# Altium schematic sheet CPU.SchDoc: CPU
size A4; DrawnBy: Mangelschots Emiel; SheetNumber: 5; SheetTotal: 5; Parameter 1: /; Parameter 2: 1EAID 12302093
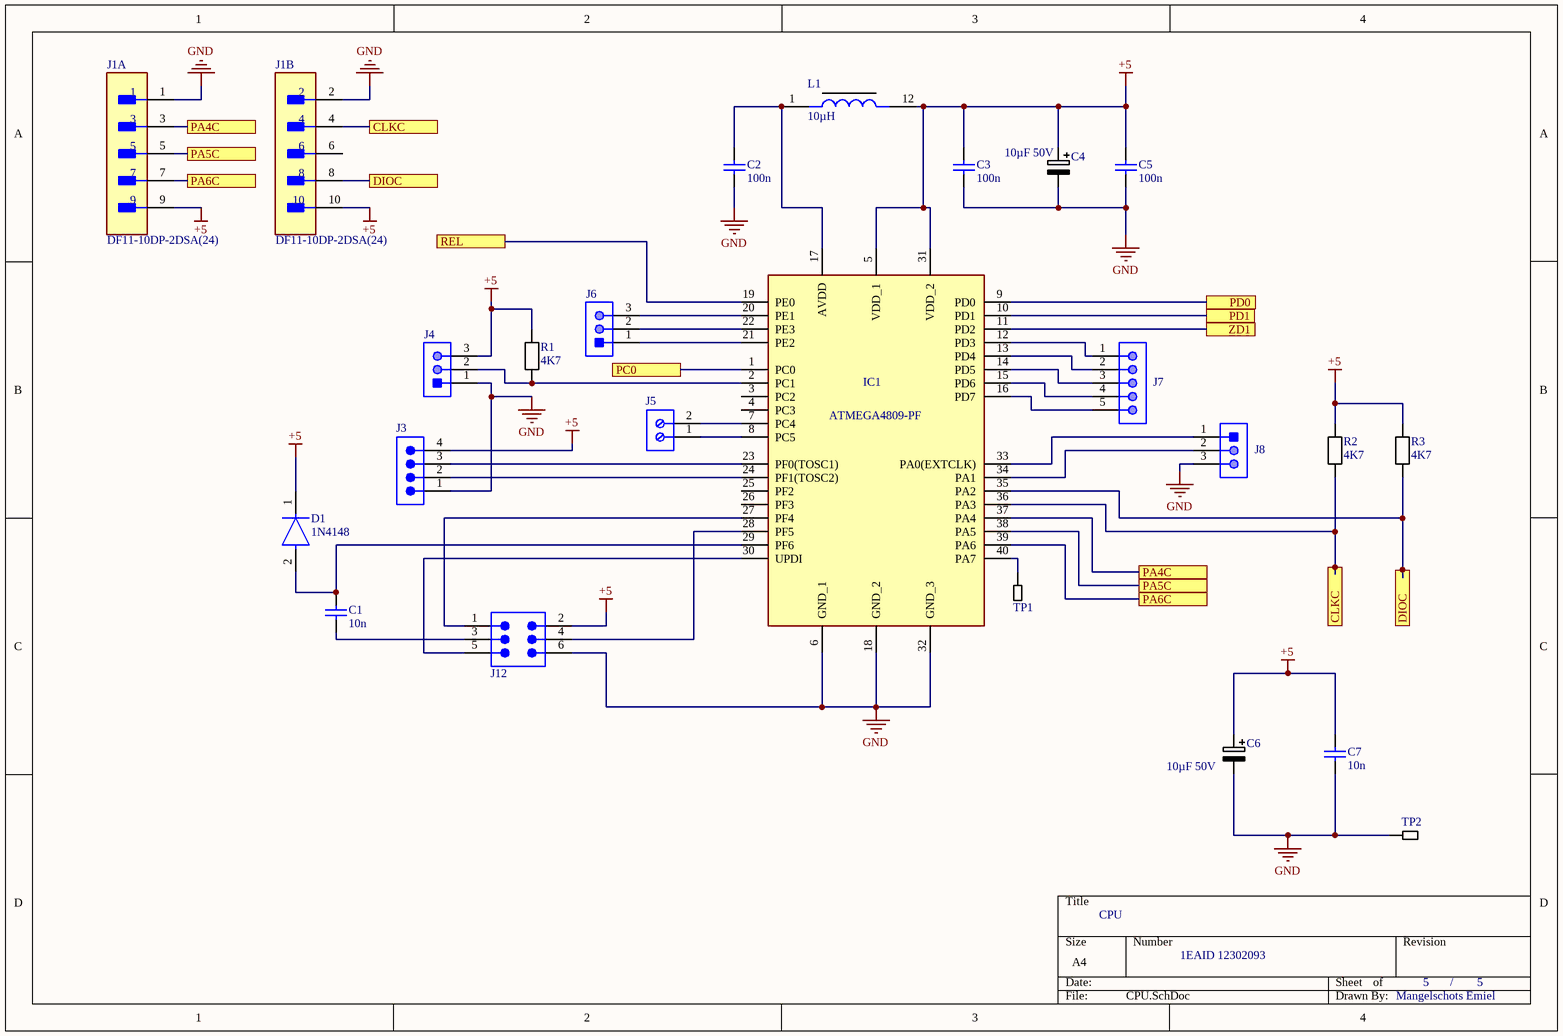
[diagram p0: CPU.SchDoc]

## Parts
C1  10n  [CAPA]
C2  100n  [CAPA]
C3  100n  [CAPA]
C4  10µF 50V  [CAPA1]
C5  100n  [CAPA]
C6  10µF 50V  [CAPA1]
C7  10n  [CAPA]
D1  1N4148  [DIOD]
IC1  ATMEGA4809-PF  [CPU]
J1  DF11-10DP-2DSA(24)  [FP-DF11-10DP-2DSA_24-MFG]  (parts A,B of 2)
J3  640456-4  [4PinH]  (value not drawn)
J4  B3B-PH-K-S(LF)(SN)  [3PinH]  (value not drawn)
J5  1725656  [2 pinHeader]  (value not drawn)
J6  B3B-PH-K-S(LF)(SN)  [3PinH]  (value not drawn)
J7  53261-0571  [5PinH]  (value not drawn)
J8  B3B-PH-K-S(LF)(SN)  [3PinH]  (value not drawn)
J12  610106249121  [6Pin-Header]  (value not drawn)
L1  10µH  [Smoorspoel]
R1  4K7  [REST]
R2  4K7  [REST]
R3  4K7  [REST]
TP1  TP  [TP]  (value not drawn)
TP2  TP  [TP]  (value not drawn)

## Ports
CLKC (see CPU[1A]), CLKC (see CPU[4C]), DIOC (see CPU[1A]), DIOC (see CPU[4C]), PA4C (see CPU[1A]), PA4C (see CPU[3C]), PA5C (see CPU[1A]), PA5C (see CPU[3C]), PA6C (see CPU[1A]), PA6C (see CPU[3C]), PC0 (see SolBout[1C]), PD0 (see SolBin[1B]), PD1 (see SolBin[1C]), REL (see VoedingBat20V[1B]), ZD1 (see VoedingBat20V[3B])

## Nets
+5: C3.2 C4.1 C5.2 C6.1 C7.2 D1.1(C) IC1.5(VDD_1) IC1.31(VDD_2) J1.9 J1.10 J3.4 J4.3 J12.2 L1.12 R1.2 R2.2 R3.2
GND: C2.1 C3.1 C4.2 C5.1 C6.2 C7.1 IC1.6(GND_1) IC1.18(GND_2) IC1.32(GND_3) J1.1 J1.2 J3.1 J4.1 J8.3 J12.6 TP2.1
CLKC: IC1.36(PA3) J1.4 R2.1 ; port CLKC
DIOC: IC1.35(PA2) J1.8 R3.1 ; port DIOC
PA4C: IC1.37(PA4) J1.3 ; port PA4C
PA5C: IC1.38(PA5) J1.5 ; port PA5C
PA6C: IC1.39(PA6) J1.7 ; port PA6C
PC0: IC1.1(PC0) ; port PC0
PD0: IC1.9(PD0) ; port PD0
PD1: IC1.10(PD1) ; port PD1
REL: IC1.19(PE0) ; port REL
ZD1: IC1.11(PD2) ; port ZD1
NetC1_1: C1.1 J12.3
NetC1_2: C1.2 D1.2(A) IC1.29(PF6)
NetC2_2: C2.2 IC1.17(AVDD) L1.1
NetIC1_2: IC1.2(PC1) J4.2 R1.1
NetIC1_7: IC1.7(PC4) J5.2
NetIC1_8: IC1.8(PC5) J5.1
NetIC1_12: IC1.12(PD3) J7.1
NetIC1_13: IC1.13(PD4) J7.2
NetIC1_14: IC1.14(PD5) J7.3
NetIC1_15: IC1.15(PD6) J7.4
NetIC1_16: IC1.16(PD7) J7.5
NetIC1_20: IC1.20(PE1) J6.3
NetIC1_21: IC1.21(PE2) J6.1
NetIC1_22: IC1.22(PE3) J6.2
NetIC1_23: IC1.23(PF0(TOSC1)) J3.3
NetIC1_24: IC1.24(PF1(TOSC2)) J3.2
NetIC1_27: IC1.27(PF4) J12.1
NetIC1_28: IC1.28(PF5) J12.4
NetIC1_30: IC1.30(UPDI) J12.5
NetIC1_33: IC1.33(PA0(EXTCLK)) J8.1
NetIC1_34: IC1.34(PA1) J8.2
NetIC1_40: IC1.40(PA7) TP1.1

Not connected (* = marked no-connect by the designer): IC1 3(PC2) 4(PC3) 25(PF2) 26(PF3); J1 6

## Library data of the parts
C1-C3 C5 C7 = Capasitor: Part Number: GRM1885C1H100JA01D; Manufacturer: Murata
C4 C6 = Capasitor_1: Part Number: GRM1885C1H100JA01D; Manufacturer: Murata
D1 = Diode: 1N4001-E3/54; Max Surge Current: 30A; Forward Voltage: 1.1V; Average Rectified Current: 1A; Voltage: 50V; Capacitance: 15pF; Peak Non-Repetitive Surge Current: 45A; Polarity: Standard; Max Reverse Current: 5uA; Element Configuration: Single; Length: 0.204inch; Diameter: 2.7mm; Mount: Through Hole; Package Quantity: 5500; Series: -; Radiation Hardening: No; Width: 2.7mm; Max Forward Surge Current (Ifsm): 30A; Current Rating: 1A; Height: 2.7mm; Forward Current: 1A; Lead Free: Lead Free; Min Operating Temperature: -50°C; Number of Pins: 2; RoHS Compliant: Yes; Packaging: Tape and Reel; Current: 1A; Max Reverse Voltage (DC): 50V; Output Current: 1A; Reverse Voltage: 50V; Case/Package: DO-204AL; Max Repetitive Reverse Voltage (Vrrm): 50V; Voltage Rating (DC): 50V; Max Operating Temperature: 150°C
IC1 = CPU: IC MCU 8BIT 48KB FLASH 40DIP ATMEGA4809-PF; RoHS Compliant: Yes
J1 = CMP-11610-000008-1: CONN HEADER VERT 10POS 2MM; Manufacturer: Hirose; Number Of Contacts: 10; Voltage Rating: 250V; Conn Orientation: Straight; Conn Gender: Male; Current Rating: 2A; Temperature Range High: +85°C; RoHS: TRUE; Device Class L2: Headers and Wire Housings; ComponentLink2URL: https://www.hirose.com/product/document?clcode=CL0543-0520-0-24&productname=DF11-10DP-2DSA(24)&series=DF11&documenttype=Catalog&lang=en&documentid=D31688_en; Height: 6.9mm; Package: DF11-10DP-2DSA(24); ComponentLink2Description: Datasheet; Automotive: No; Digikey Description: CONN HEADER VERT 10POS 2MM; Manufacturer Part Number: DF11-10DP-2DSA(24); Temperature: -40°C to +85°C; Octopart: https://octopart.com/df11-10dp-2dsa%2824%29-hirose-39521433; Number Of Rows: 2; Device Class L3: unset; Contact Material: Tin,Nickel; Mouser Description: Headers & Wire Housings 10P STRT HEADER THRU HL,BD MNT,SN; Category: Conn; Device Class L1: Connectors; Temperature Range Low: -40°C; Pitch: 2mm; Lead Free: Yes; Footprint Url: https://www.hirose.com/product/document?clcode=CL0543-0520-0-24&productname=DF11-10DP-2DSA(24)&series=DF11&documenttype=2DDrawing&lang=en&documentid=0000995333
J3 = 4Pin-Header: Manufacturer: TE Connectivity; Material, Housing: Polyester; Primary Type: InterconnectSystem; Mount Angle: Vertical; Color, Housing: White; Current, Rating: 5 / A; Agency Approvals: CSA,UL; Contact Termination Area Plating: Tin; Temperature, Operating: -55to+105 / degC; Standards: RoHSCompliant,ELVCompliant,UL94V-0; Number of Positions: 4; Brand/Series: MTA-100Series; Angle: Straight; Pin Spacing: 0.1 / "; Material, Contact: CopperAlloy; Connector Type: MTA-100; Special Features: Pinstrip; Mounting Hole Size: 0.04 / "; Contact Centerline Spacing: 0.100 / in.; Voltage, Rating: 250 / V; Manufacturer URL: http://www.te.com/; Length, Pin: 0.14 / "; Length, Overall: 0.4 / "; Color: White; Flammability Rating: UL94V-0; Mounting Type: PCMount; Termination: Solder; Datasheet URL: https://datasheet.ciiva.com/16286/eng-ds-82056-mta-0608-16286228.pdf; Number of Contacts: 4; Contact Shape: Square; Contact Mating Area Plating: Tin; Length, Terminal Post: 0.14 / in.; Size, Post: 0.025 / in.; Contact Plating: Tin; Type: PCBPlug; Datasheet Version: Dec-14; Number of Rows: 1
J4 J6 J8 = 3Pin-Header: Manufacturer: JST; Style/Orientation: StraightHeader/Plug; Pitch: 2mm; No of Positions: 3; Termination: Crimp; Manufacturer URL: http://www.jst.com/home2.html; Datasheet Version: Oct-06; Type: ShroudedHeader; Datasheet URL: https://datasheet.ciiva.com/11746/0900766b80826550-11746939.pdf
J5 = 2Pin-Header: Manufacturer: Phoenix Contact; Number of contacts: 2; Content: 250pc(s); Pitch: 2.54mm; Industrial packaging: Yes; Colour: Green; Manufacturer part No.: 1725656; Type: MPT0,5/2-2,54; Datasheet URL: http://datasheet.octopart.com/1725656-Phoenix-Contact-datasheet-5302866.pdf; Manufacturer URL: http://www.phoenixcontact.com/; Datasheet Version: Apr-08
J7 = 5Pin-Header: Brand: Molex; Mounting Angle: Right; Number of Positions: 5; Voltage Rating: 125V; Current Rating: 1A; Pitch: 1.25mm; Datasheet Version: Rev. D, 04/2004; Housing Material: Thermoplastic; Series: 53261; RoHS: Details; Product Category: Headers&WireHousings; Datasheet URL: http://datasheet.octopart.com/532610571-Molex-datasheet-8343080.pdf; Manufacturer URL: http://www.molex.com/; Contact Material: PhosphorBronze; Tradename: PicoBlade; Number of Rows: 1; Product Type: Headers; Manufacturer: Molex; Type: Shrouded; Termination Style: SMD; Mounting Style: SMD/SMT; Factory Pack Quantity: 1000; Contact Plating: Tin; Packaging: Reel; Number of Positions / Contacts: 5
J12 = 6Pin-Header: CMP-1502-01146-2; NexarPartId: 52645089; Connector Type: Male Pin; Gender: Male; Contact Resistance: 20mΩ; Number of Contacts: 6; Current Rating: 3A; Pitch: 2.54mm; Operating Supply Voltage: 250V; Contact Plating: Gold; Mount: Surface Mount; RoHS: Compliant; REACH SVHC: Unknown; Packaging: Tape and Reel; Lead Pitch: 2.54mm; Termination: Solder; Color: Black; Contact Mating Length: 5.9944mm; Number of Positions: 6; Number of Rows: 2; Number of Pins: 6; Row Spacing: 2.54mm
L1 = SmoorSpoel: Surface Mount High Frequency Inductor, NLV Series, 10 H, 5%, 1008 [2520 Metric], 33 MHz, 3.5 ohm NLV25T-100J-EF; MF: TDK; Availability: In Stock; Purchase-URL: https://pricing.snapeda.com/search/part/NLV25T-100J-EF/?ref=eda; SnapEDA_Link: https://www.snapeda.com/parts/NLV25T-100J-EF/TDK/view-part/?ref=snap; MP: NLV25T-100J-EF; Price: None; Package: SMD-2 TDK; Value: *; Check_prices: https://www.snapeda.com/parts/NLV25T-100J-EF/TDK/view-part/?ref=eda
R1-R3 = resistor: Manufacturer: Vishay Dale; Part Number: CRCW08050000Z0EA
TP1 TP2 = TP: Part Number: GRM1885C1H100JA01D; Manufacturer: Murata